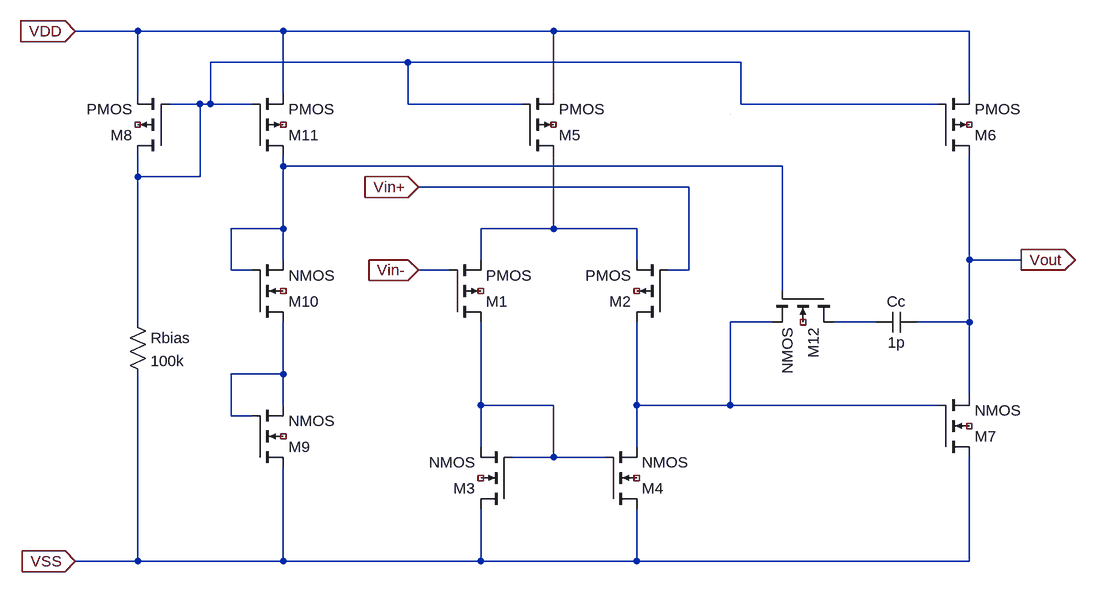
[diagram p0: schematic opamp.asc]
opamp.asc, the LTspice schematic file:
Version 4
SHEET 1 880 760
WIRE -912 -128 -1008 -128
WIRE -688 -128 -912 -128
WIRE -272 -128 -688 -128
WIRE 368 -128 -272 -128
WIRE -496 -80 -800 -80
WIRE 16 -80 -496 -80
WIRE -912 -32 -912 -128
WIRE -688 -32 -688 -128
WIRE -272 -32 -272 -128
WIRE 368 -32 368 -128
WIRE -816 -16 -864 -16
WIRE -800 -16 -800 -80
WIRE -800 -16 -816 -16
WIRE -736 -16 -800 -16
WIRE -496 -16 -496 -80
WIRE -320 -16 -496 -16
WIRE 16 -16 16 -80
WIRE 320 -16 16 -16
WIRE -688 80 -688 64
WIRE 80 80 -688 80
WIRE -912 96 -912 64
WIRE -816 96 -816 -16
WIRE -816 96 -912 96
WIRE -64 112 -480 112
WIRE -688 176 -688 80
WIRE -688 176 -768 176
WIRE -272 176 -272 64
WIRE -272 176 -384 176
WIRE -144 176 -272 176
WIRE -688 224 -688 176
WIRE -384 224 -384 176
WIRE -144 224 -144 176
WIRE 368 224 368 64
WIRE 448 224 368 224
WIRE -768 240 -768 176
WIRE -736 240 -768 240
WIRE -432 240 -480 240
WIRE -64 240 -64 112
WIRE -64 240 -96 240
WIRE 80 272 80 80
WIRE -912 320 -912 96
WIRE 64 320 0 320
WIRE 224 320 160 320
WIRE 368 320 368 224
WIRE 368 320 288 320
WIRE -688 400 -688 320
WIRE -688 400 -768 400
WIRE 368 432 368 320
WIRE -688 448 -688 400
WIRE -384 448 -384 320
WIRE -272 448 -384 448
WIRE -144 448 -144 320
WIRE 0 448 0 320
WIRE 0 448 -144 448
WIRE 320 448 0 448
WIRE -768 464 -768 400
WIRE -736 464 -768 464
WIRE -384 512 -384 448
WIRE -144 512 -144 448
WIRE -272 528 -272 448
WIRE -272 528 -336 528
WIRE -192 528 -272 528
WIRE -912 688 -912 400
WIRE -912 688 -1008 688
WIRE -688 688 -688 544
WIRE -688 688 -912 688
WIRE -384 688 -384 608
WIRE -384 688 -688 688
WIRE -144 688 -144 608
WIRE -144 688 -384 688
WIRE 368 688 368 528
WIRE 368 688 -144 688
WIRE 0 0 0 0
FLAG -1008 -128 VDD
IOPIN -1008 -128 In
FLAG -1008 688 VSS
IOPIN -1008 688 In
FLAG 448 224 Vout
IOPIN 448 224 Out
FLAG -480 112 Vin+
IOPIN -480 112 In
FLAG -480 240 Vin-
IOPIN -480 240 In
SYMBOL pmos4 320 64 M180
SYMATTR InstName M6
SYMBOL pmos4 -320 64 M180
SYMATTR InstName M5
SYMBOL pmos4 -432 320 M180
SYMATTR InstName M1
SYMBOL pmos4 -96 320 R180
SYMATTR InstName M2
SYMBOL pmos4 -736 64 M180
SYMATTR InstName M11
SYMBOL pmos4 -864 64 R180
SYMATTR InstName M8
SYMBOL nmos4 -192 608 M180
SYMATTR InstName M4
SYMBOL nmos4 -336 608 R180
SYMATTR InstName M3
SYMBOL nmos4 320 528 M180
SYMATTR InstName M7
SYMBOL nmos4 160 272 R90
SYMATTR InstName M12
SYMBOL nmos4 -736 320 M180
SYMATTR InstName M10
SYMBOL nmos4 -736 544 M180
SYMATTR InstName M9
SYMBOL res -928 304 R0
SYMATTR InstName Rbias
SYMATTR Value 100k
SYMBOL cap 288 304 R90
WINDOW 0 0 32 VBottom 2
WINDOW 3 32 32 VTop 2
SYMATTR InstName Cc
SYMATTR Value 1p

The netlist it stands for:
* opamp.asc
M6 Vout N001 VDD NC_01 PMOS
M5 N003 N001 VDD NC_02 PMOS
M1 N007 Vin- N003 NC_03 PMOS
M2 N004 Vin+ N003 NC_04 PMOS
M11 N002 N001 VDD NC_05 PMOS
M8 N001 N001 VDD NC_06 PMOS
M4 VSS N007 N004 NC_07 NMOS
M3 VSS N007 N007 NC_08 NMOS
M7 VSS N004 Vout NC_09 NMOS
M12 N005 N002 N004 NC_10 NMOS
M10 N006 N002 N002 NC_11 NMOS
M9 VSS N006 N006 NC_12 NMOS
Rbias N001 VSS 100k
Cc Vout N005 1p
.model NMOS NMOS
.model PMOS PMOS
.lib standard.mos
.backanno
.end